# EAGLE design VIC20_SExpII (EAGLE 9.5.2)
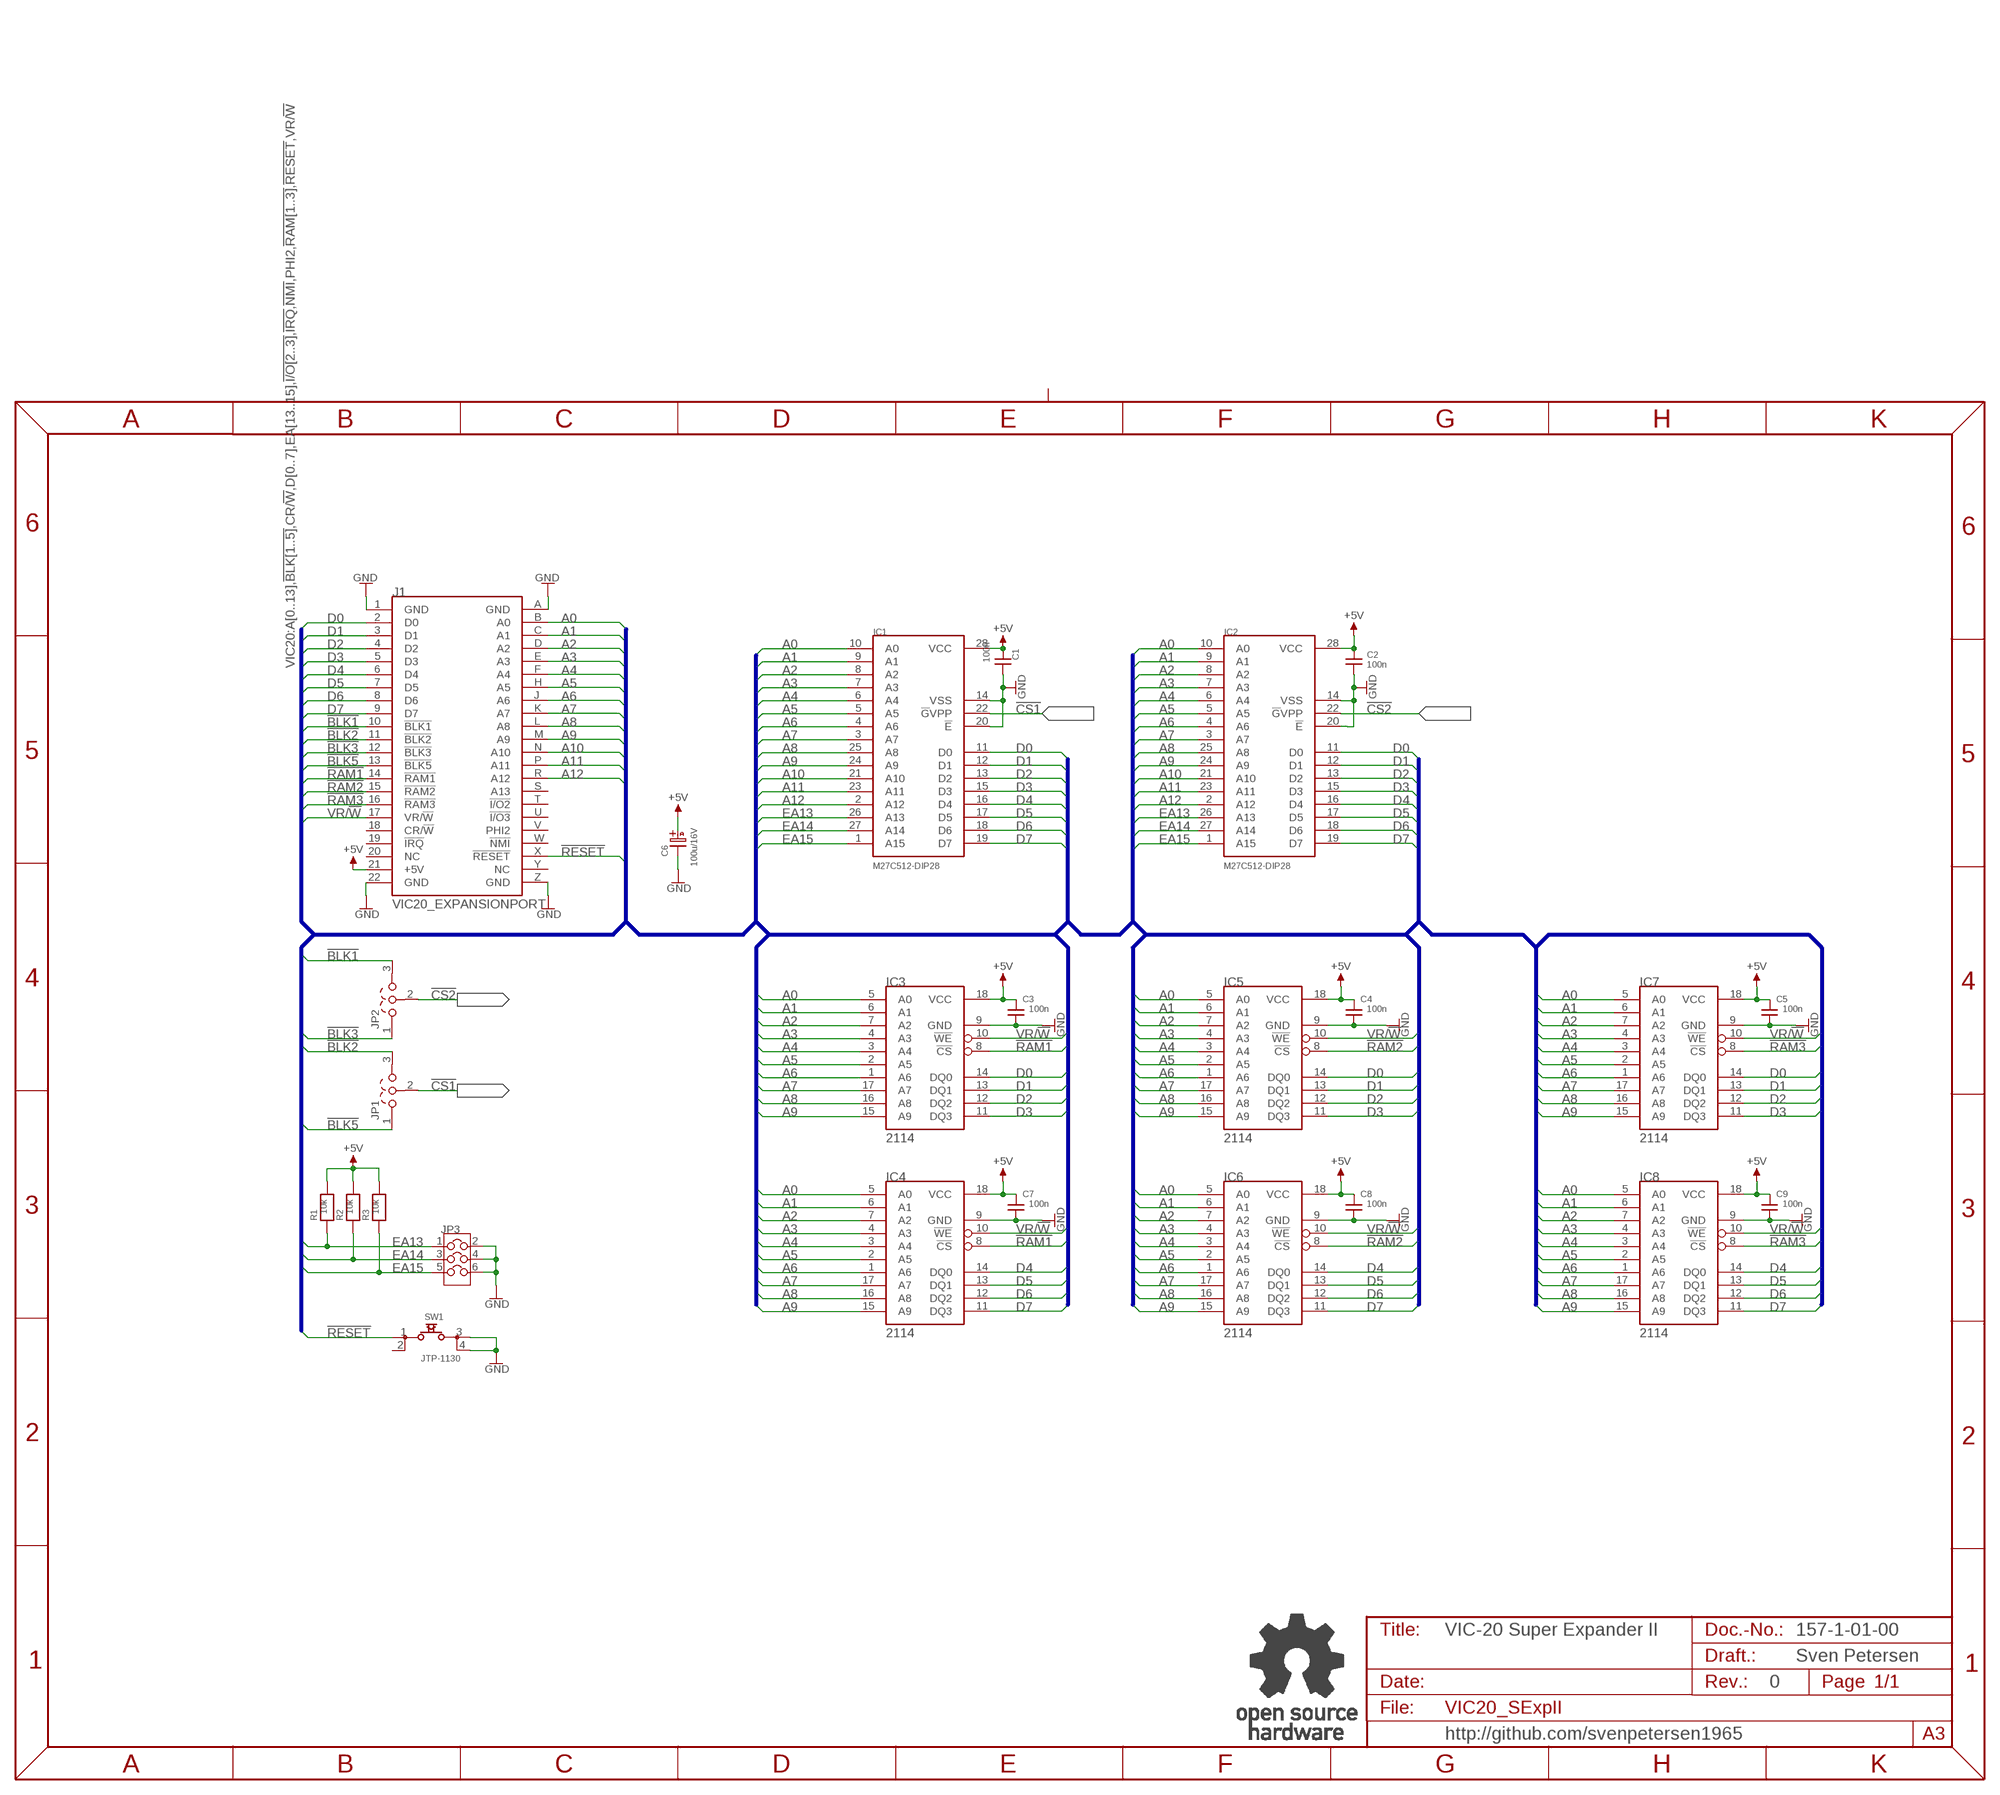
[diagram p0: schematic, sheet 1]

## Parts
C1  100n  CAP01  [C-2,5]
C2  100n  CAP01  [C-2,5]
C3  100n  CAP01  [C-2,5]
C4  100n  CAP01  [C-2,5]
C5  100n  CAP01  [C-2,5]
C6  100u/16V  C07/2,5  [C07/2,5]
C7  100n  CAP01  [C-2,5]
C8  100n  CAP01  [C-2,5]
C9  100n  CAP01  [C-2,5]
IC1  M27C512-DIP28  [DIL28-6]
IC2  M27C512-DIP28  [DIL28-6]
IC3  2114  [DIL18]
IC4  2114  [DIL18]
IC5  2114  [DIL18]
IC6  2114  [DIL18]
IC7  2114  [DIL18]
IC8  2114  [DIL18]
J1  VIC20_EXPANSIONPORT  [VIC20_EXPANSION]
JP1  COMBI-3P  [COMBI-3P]
JP2  COMBI-3P  [COMBI-3P]
JP3  COMBI-3X2P  [COMBI-3X2]
R1  10k  RES04  [R-10]
R2  10k  RES04  [R-10]
R3  10k  RES04  [R-10]
SW1  JTP-1130  [JTP-1130]
U$2  OPEN_SOURCE_HW  [OPENHW]

## Nets
!BLK1: J1.10(!BLK1) JP2.3
!BLK2: J1.11(!BLK2) JP1.3
!BLK3: J1.12(!BLK3) JP2.1
!BLK5: J1.13(!BLK5) JP1.1
!CS1: IC1.22(!G!VPP) JP1.2
!CS2: IC2.22(!G!VPP) JP2.2
!RAM1: IC3.8(!CS) IC4.8(!CS) J1.14(!RAM1)
!RAM2: IC5.8(!CS) IC6.8(!CS) J1.15(!RAM2)
!RAM3: IC7.8(!CS) IC8.8(!CS) J1.16(!RAM3)
!RESET: J1.X(!RESET) SW1.1
+5V: C1.1 C2.1 C3.2 C4.2 C5.2 C6.A(+) C7.2 C8.2 C9.2 IC1.28(VCC) IC2.28(VCC) IC3.18(VCC) IC4.18(VCC) IC5.18(VCC) IC6.18(VCC) IC7.18(VCC) IC8.18(VCC) J1.21(+5V) R1.2 R2.2 R3.2
A0: IC1.10(A0) IC2.10(A0) IC3.5(A0) IC4.5(A0) IC5.5(A0) IC6.5(A0) IC7.5(A0) IC8.5(A0) J1.B(A0)
A1: IC1.9(A1) IC2.9(A1) IC3.6(A1) IC4.6(A1) IC5.6(A1) IC6.6(A1) IC7.6(A1) IC8.6(A1) J1.C(A1)
A2: IC1.8(A2) IC2.8(A2) IC3.7(A2) IC4.7(A2) IC5.7(A2) IC6.7(A2) IC7.7(A2) IC8.7(A2) J1.D(A2)
A3: IC1.7(A3) IC2.7(A3) IC3.4(A3) IC4.4(A3) IC5.4(A3) IC6.4(A3) IC7.4(A3) IC8.4(A3) J1.E(A3)
A4: IC1.6(A4) IC2.6(A4) IC3.3(A4) IC4.3(A4) IC5.3(A4) IC6.3(A4) IC7.3(A4) IC8.3(A4) J1.F(A4)
A5: IC1.5(A5) IC2.5(A5) IC3.2(A5) IC4.2(A5) IC5.2(A5) IC6.2(A5) IC7.2(A5) IC8.2(A5) J1.H(A5)
A6: IC1.4(A6) IC2.4(A6) IC3.1(A6) IC4.1(A6) IC5.1(A6) IC6.1(A6) IC7.1(A6) IC8.1(A6) J1.J(A6)
A7: IC1.3(A7) IC2.3(A7) IC3.17(A7) IC4.17(A7) IC5.17(A7) IC6.17(A7) IC7.17(A7) IC8.17(A7) J1.K(A7)
A8: IC1.25(A8) IC2.25(A8) IC3.16(A8) IC4.16(A8) IC5.16(A8) IC6.16(A8) IC7.16(A8) IC8.16(A8) J1.L(A8)
A9: IC1.24(A9) IC2.24(A9) IC3.15(A9) IC4.15(A9) IC5.15(A9) IC6.15(A9) IC7.15(A9) IC8.15(A9) J1.M(A9)
A10: IC1.21(A10) IC2.21(A10) J1.N(A10)
A11: IC1.23(A11) IC2.23(A11) J1.P(A11)
A12: IC1.2(A12) IC2.2(A12) J1.R(A12)
D0: IC1.11(D0) IC2.11(D0) IC3.14(DQ0) IC5.14(DQ0) IC7.14(DQ0) J1.2(D0)
D1: IC1.12(D1) IC2.12(D1) IC3.13(DQ1) IC5.13(DQ1) IC7.13(DQ1) J1.3(D1)
D2: IC1.13(D2) IC2.13(D2) IC3.12(DQ2) IC5.12(DQ2) IC7.12(DQ2) J1.4(D2)
D3: IC1.15(D3) IC2.15(D3) IC3.11(DQ3) IC5.11(DQ3) IC7.11(DQ3) J1.5(D3)
D4: IC1.16(D4) IC2.16(D4) IC4.14(DQ0) IC6.14(DQ0) IC8.14(DQ0) J1.6(D4)
D5: IC1.17(D5) IC2.17(D5) IC4.13(DQ1) IC6.13(DQ1) IC8.13(DQ1) J1.7(D5)
D6: IC1.18(D6) IC2.18(D6) IC4.12(DQ2) IC6.12(DQ2) IC8.12(DQ2) J1.8(D6)
D7: IC1.19(D7) IC2.19(D7) IC4.11(DQ3) IC6.11(DQ3) IC8.11(DQ3) J1.9(D7)
EA13: IC1.26(A13) IC2.26(A13) JP3.1 R1.1
EA14: IC1.27(A14) IC2.27(A14) JP3.3 R2.1
EA15: IC1.1(A15) IC2.1(A15) JP3.5 R3.1
GND: C1.2 C2.2 C3.1 C4.1 C5.1 C6.K(-) C7.1 C8.1 C9.1 IC1.14(VSS) IC1.20(!E) IC2.14(VSS) IC2.20(!E) IC3.9(GND) IC4.9(GND) IC5.9(GND) IC6.9(GND) IC7.9(GND) IC8.9(GND) J1.1(GND) J1.22(GND) J1.A(GND) J1.Z(GND) JP3.2 JP3.4 JP3.6 SW1.3 SW1.4
VR/!W: IC3.10(!WE) IC4.10(!WE) IC5.10(!WE) IC6.10(!WE) IC7.10(!WE) IC8.10(!WE) J1.17(VR/!W)
Unconnected: J1.18(CR/!W) J1.19(!IRQ) J1.S(A13) J1.T(!I/O2) J1.U(!I/O3) J1.V(PHI2) J1.W(!NMI) J1.Y(NC) SW1.2

## Buses
VIC20:A[0..13],!BLK[1..5],CR/!W,D[0..7],EA[13..15],!I/O[2..3],!IRQ,!NMI,PHI2,!RAM[1..3],!RESET,VR/!W

## Notes on the sheet
- VIC-20 Super Expander II | 157-1-01-00
- Sven Petersen
- 0
- http://github.com/svenpetersen1965

## Power pins joined to a net without a drawn wire
NC: J1.20(NC)

## Library data of the parts
C1-C5 C7-C9 = DISCRETE:CAP01
C6 = ELCO:C07/2,5
IC1 IC2 = ST:M27C512
IC3-IC8 = MOS:2114
J1 = Commodore:VIC20_EXPANSIONPORT
JP1 JP2 = Cutpad:COMBI-3P
JP3 = Cutpad:COMBI-3X2P
R1-R3 = DISCRETE:RES04
SW1 = Namae_Electronics:JTP-1130
U$2 = Logo:OPEN_SOURCE_HW

## Board
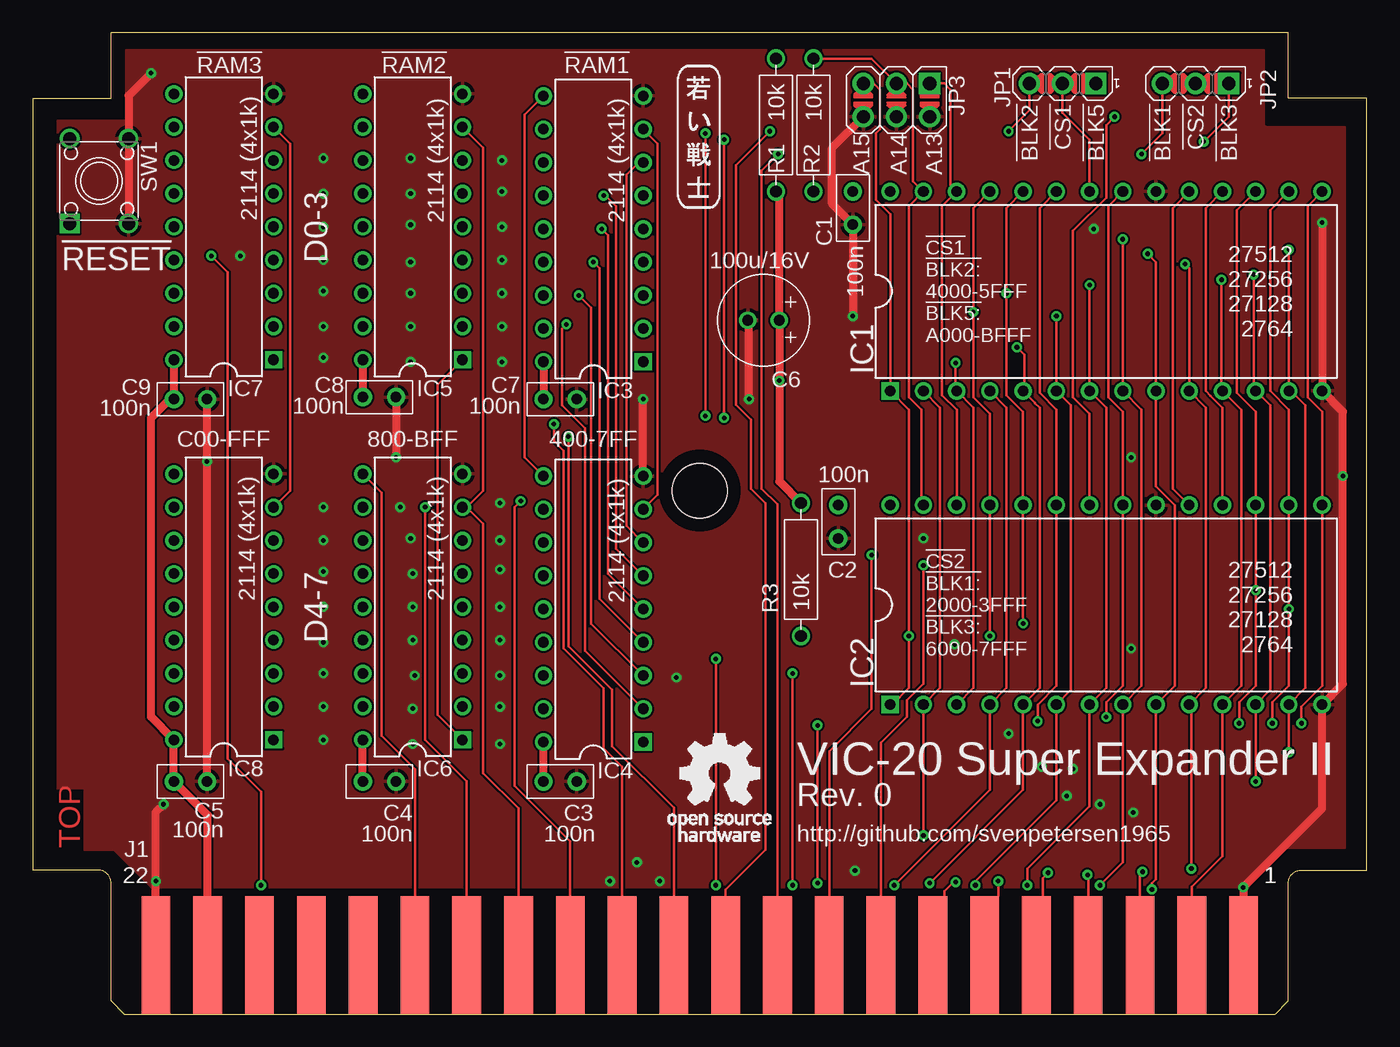
[diagram p1: board, top side]
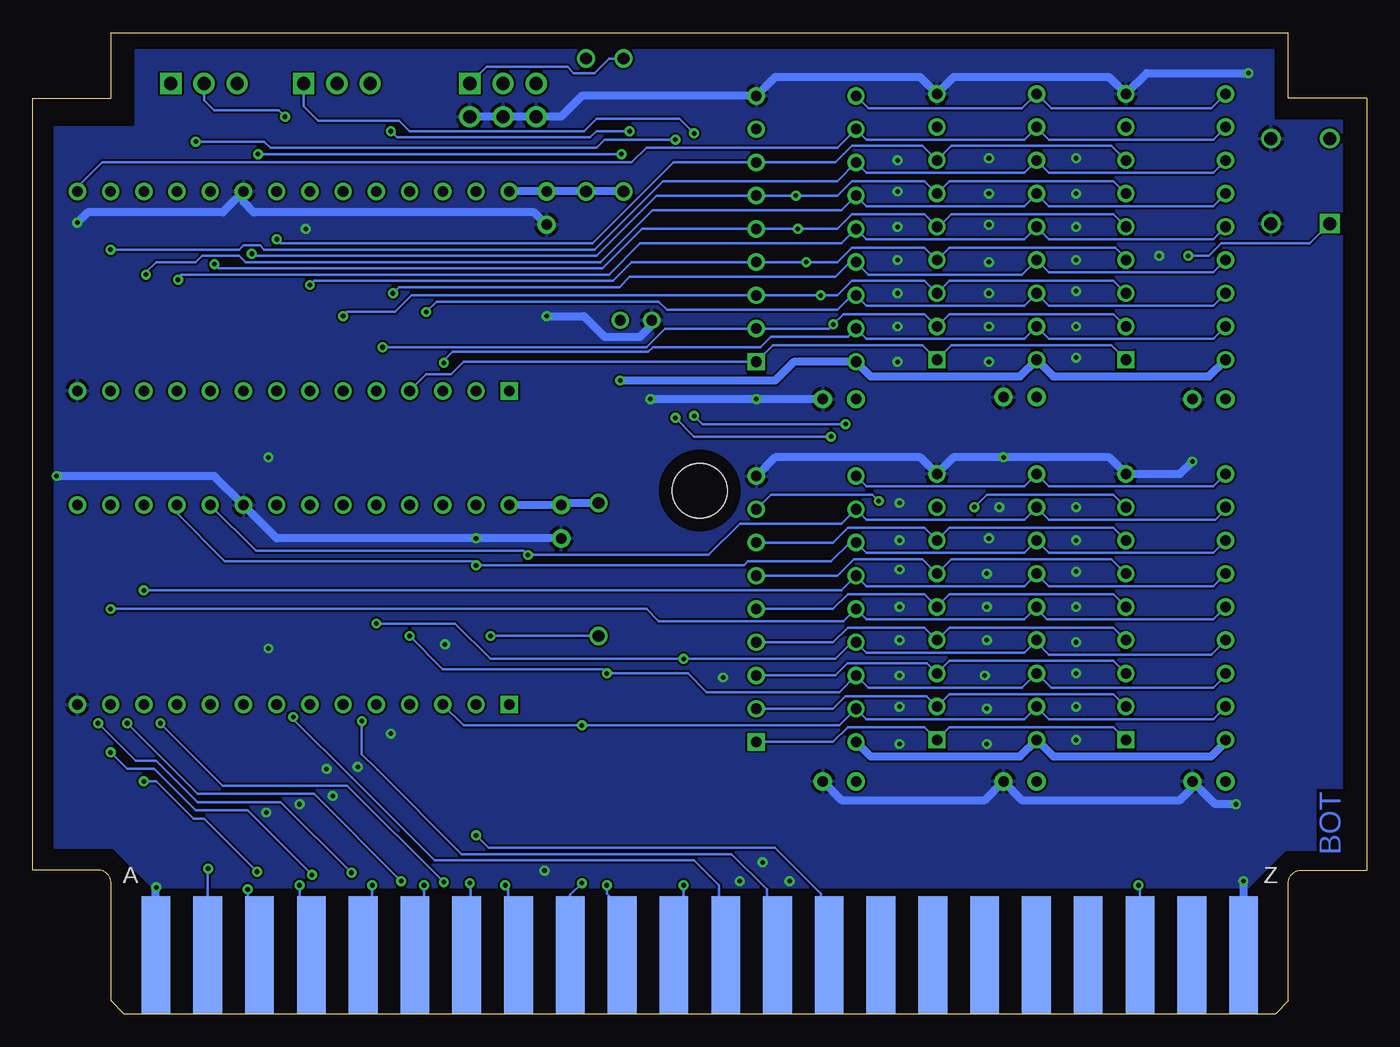
[diagram p2: board, bottom side, seen from below]

Size 102 x 75 mm. Coordinates in mm from the lower left corner, seen from the top.
Outline: 102,11 102,70 96,70 96,75 6,75 6,70 0,70 0,11
Copper layers (1*16): Top 0.035mm / dielectric 1.5mm / Bottom 0.035mm
Design rules "default *": minimum track width 6mil, minimum drill 0.35mm, track to track 6mil, track to pad 6mil, pad to pad 6mil, via to via 6mil, smd to smd 6mil, copper to edge 40mil, drill to drill 6mil, minimum pad ring 10mil, minimum via ring 8mil, stop-mask expansion 4mil, vias tented up to drill 23mil, thermal gap 10mil
Holes 4.2 mm at 51,40

### Footprints (pad centres in the part's own frame; a part is rotated, then mirrored left to right if it is on the bottom)
C-2,5 = drill 0.8 pad 1.397: 1 -1.27,0; 2 1.27,0
C07/2,5 = drill 0.813 pad 1.27: A -1.202,0; K 1.202,0
DIL28-6 = drill 0.813 square: 1 -16.51,-7.62 | drill 0.813: 2 -13.97,-7.62; 3 -11.43,-7.62; 4 -8.89,-7.62; 5 -6.35,-7.62; 6 -3.81,-7.62; 7 -1.27,-7.62; 8 1.27,-7.62; 9 3.81,-7.62; 10 6.35,-7.62; 11 8.89,-7.62; 12 11.43,-7.62; 13 13.97,-7.62; 14 16.51,-7.62; 15 16.51,7.62; 16 13.97,7.62; 17 11.43,7.62; 18 8.89,7.62; 19 6.35,7.62; 20 3.81,7.62; 21 1.27,7.62; 22 -1.27,7.62; 23 -3.81,7.62; 24 -6.35,7.62; 25 -8.89,7.62; 26 -11.43,7.62; 27 -13.97,7.62; 28 -16.51,7.62
DIL18 = drill 0.813 square: 1 -10.16,-3.81 | drill 0.813: 2 -7.62,-3.81; 3 -5.08,-3.81; 4 -2.54,-3.81; 5 0,-3.81; 6 2.54,-3.81; 7 5.08,-3.81; 8 7.62,-3.81; 9 10.16,-3.81; 10 10.16,3.81; 11 7.62,3.81; 12 5.08,3.81; 13 2.54,3.81; 14 0,3.81; 15 -2.54,3.81; 16 -5.08,3.81; 17 -7.62,3.81; 18 -10.16,3.81
VIC20_EXPANSION = smd 2.2 x 9: 1 41.58,4.5; 2 37.62,4.5; 3 33.66,4.5; 4 29.7,4.5; 5 25.74,4.5; 6 21.78,4.5; 7 17.82,4.5; 8 13.86,4.5; 9 9.9,4.5; 10 5.94,4.5; 11 1.98,4.5; 12 -1.98,4.5; 13 -5.94,4.5; 14 -9.9,4.5; 15 -13.86,4.5; 16 -17.82,4.5; 17 -21.78,4.5; 18 -25.74,4.5; 19 -29.7,4.5; 20 -33.66,4.5; 21 -37.62,4.5; 22 -41.58,4.5 | smd 2.2 x 9 bottom: A 41.58,4.5; B 37.62,4.5; C 33.66,4.5; D 29.7,4.5; E 25.74,4.5; F 21.78,4.5; H 17.82,4.5; J 13.86,4.5; K 9.9,4.5; L 5.94,4.5; M 1.98,4.5; N -1.98,4.5; P -5.94,4.5; R -9.9,4.5; S -13.86,4.5; T -17.82,4.5; U -21.78,4.5; V -25.74,4.5; W -29.7,4.5; X -33.66,4.5; Y -37.62,4.5; Z -41.58,4.5
COMBI-3P = drill 1 pad 1.626 square: 1 -2.54,0 | drill 1 pad 1.626: 2 0,0; 3 2.54,0
COMBI-3X2 = drill 1 pad 1.626 square: 1 -1.27,2.54 | drill 1 pad 1.626: 2 1.27,2.54; 3 -1.27,0; 4 1.27,0; 5 -1.27,-2.54; 6 1.27,-2.54
R-10 = drill 0.889 pad 1.397: 1 -5.08,0; 2 5.08,0
JTP-1130 = drill 1 square: 1 3.25,-2.25 | drill 1: 2 -3.25,-2.25; 3 3.25,2.25; 4 -3.25,2.25

### Placement (x,y rotation side)
C1  62.71,61.59 270 top
C2  61.59,37.62 270 top
C3  40.32,17.78 180 top
C4  26.51,17.78 180 top
C5  12.06,17.78 180 top
C6  55.88,53.02 180 top
C7  40.32,46.99 180 top
C8  26.51,47.15 180 top
C9  12.06,46.99 180 top
IC1  82.07,55.24 0 top
IC2  82.07,31.27 0 top
IC3  42.86,60.01 90 top
IC4  42.86,30.96 90 top
IC5  29.05,60.17 90 top
IC6  29.05,31.11 90 top
IC7  14.61,60.17 90 top
IC8  14.61,31.11 90 top
J1  51,0 0 top
JP1  78.74,71.12 180 top
JP2  88.9,71.12 180 top
JP3  66.04,69.85 270 top
R1  56.83,67.94 270 top
R2  59.69,67.94 270 top
R3  58.74,33.97 90 top
SW1  5.08,63.66 270 top
U$2  48.58,13.18 0 top
U$15  [SVEN_TAG]  50.96,67.15 0 top
U$16  [2LAYER]  3.65,12.7 90 top
U$40  [PCB-TITLE/]  0,87 0 top  (outside the outline)

### Tracks (layer width: path | path; a pad name or v marks a point on that pad's centre or on a via)
!BLK1  (via drill 0.35)
  Top 0.203: J1.10 56.94,38.95 55.72,40.16 55.72,64.45 v56.99,65.72 | v84.77,65.72 86.36,67.31 JP2.3
  Bottom 0.203: v56.99,65.72 v84.77,65.72
!BLK2  (via drill 0.35)
  Top 0.203: J1.11 52.98,9.48 56.04,12.54 56.04,39.05 54.93,40.16 54.93,45.4 53.76,46.57 53.76,64.88 v56.36,67.47 | v74.61,67.47 76.2,69.06 JP1.3
  Bottom 0.203: v56.36,67.47 58.9,67.47 59.37,66.99 74.14,66.99 v74.61,67.47
!BLK3  (via drill 0.35)
  Top 0.203: J1.12 49.02,15.75 44.29,20.48 44.29,24.77 40.96,28.1 v40.96,44.13 | v52.86,45.56 v52.86,66.83 | v89.53,66.67 91.44,68.58 JP2.1
  Bottom 0.203: v40.96,44.13 51.44,44.13 v52.86,45.56 | v52.86,66.83 58.26,66.83 58.9,66.2 83.82,66.2 84.3,66.67 v89.53,66.67
!BLK5  (via drill 0.35)
  Top 0.203: J1.13 45.06,18.92 43.66,20.32 43.66,24.9 40.6,27.95 40.6,43.06 39.85,43.81 v39.85,45.09 | v51.44,45.72 v51.44,67.31
  Bottom 0.203: v39.85,45.09 50.8,45.09 v51.44,45.72 | v51.44,67.31 52.55,68.42 58.9,68.42 59.85,67.47 73.18,67.47 73.98,68.26 80.17,68.26 81.28,69.37 JP1.1
!CS1
  Top 0.203: IC1.22 80.8,66.83 78.74,68.9 JP1.2
!CS2  (via drill 0.35)
  Top 0.203: IC2.22 80.8,45.88 79.53,47.15 79.53,59.85 82.07,62.39 82.07,67.94 v82.71,68.58
  Bottom 0.203: v82.71,68.58 83.19,69.06 88.11,69.06 88.9,69.85 JP2.2
!RAM1  (via drill 0.35)
  Top 0.203: IC4.8 47.78,39.69 47.78,41.33 47.78,66.52 IC3.8 | J1.14 41.1,13.19 36.83,17.46 36.83,38.73 v37.31,39.21
  Bottom 0.203: v37.31,39.21 37.78,39.69 45.56,39.69 IC4.8
!RAM2
  Top 0.203: IC5.8 34.45,66.2 34.45,40.01 33.18,38.73 | 33.18,38.73 IC6.8 33.18,38.73 | J1.15 37.14,15.72 34.45,18.41 34.45,37.47 33.18,38.73
!RAM3  (via drill 0.35)
  Top 0.203: J1.16 33.18,17.78 30,20.95 v30,38.73 | IC8.8 19.68,40.01 19.68,66.52 IC7.8
  Bottom 0.203: v30,38.73 29.05,39.69 19.37,39.69 IC8.8
!RESET  (via drill 0.35)
  Top 0.203: v17.46,9.84 17.46,16.99 14.92,19.53 14.92,56.67 v13.65,57.94
  Bottom 0.203: J1.X 17.34,9.72 v17.46,9.84 | v13.65,57.94 12.06,57.94 11.11,58.9 4.34,58.9 SW1.1
+5V  (via drill 0.35)
  Top 0.61: R1.2 57.08,62.62 C6.A v57.08,48.42 57.08,40.71 R3.2 | IC3.18 C7.2 | IC5.18 C8.2 | IC7.18 C9.2 10.48,46.99 9.05,45.56 9.05,22.7 IC8.18 C5.2 13.38,15.2 J1.21 | C4.2 IC6.18 | C3.2 IC4.18
  Bottom 0.61: IC7.18 12.06,48.74 23.97,48.74 IC5.18 26.51,48.74 37.94,48.74 IC3.18 43.81,49.85 45.24,48.42 v57.08,48.42 | IC4.18 37.94,19.68 26.51,19.68 IC6.18 23.97,19.68 11.91,19.68 10.79,20.8 IC8.18 | R1.2 R2.2 C1.1 IC1.28 | v57.08,48.42 57.15,48.42 v57.08,48.42 | R3.2 61.44,39.05 C2.1 IC2.28
A0  (via drill 0.35)
  Top 0.203: v88.11,57.31 88.42,56.99 IC1.10 89.69,46.35 89.69,24.92 IC2.10 88.58,23.5 v88.58,11.11 | IC4.5 43.97,33.66 43.97,59.53 v43.5,60.01
  Bottom 0.203: IC7.5 19.37,61.12 31.75,61.12 32.7,60.17 IC5.5 33.81,61.12 39.37,61.12 40.48,60.01 v43.5,60.01 IC3.5 55.4,60.01 58.42,56.99 87.79,56.99 v88.11,57.31 | IC4.5 40.8,30.96 39.69,32.07 33.81,32.07 IC6.5 31.91,32.07 19.37,32.07 IC8.5 | J1.B 88.62,11.07 v88.58,11.11
A1  (via drill 0.35)
  Top 0.203: v85.25,58.1 85.88,57.47 IC1.9 85.88,40.32 87.31,38.89 87.31,25.08 IC2.9 85.88,10.32 85.57,10 v85.57,9.53 | IC4.6 44.61,35.56 44.61,61.75 43.81,62.55 v43.66,62.55
  Bottom 0.203: IC7.6 19.37,63.66 31.91,63.66 IC5.6 33.81,63.66 39.37,63.66 40.48,62.55 v43.66,62.55 IC3.6 54.29,62.55 58.9,57.94 85.09,57.94 v85.25,58.1 | IC4.6 40.48,33.5 39.21,34.77 33.97,34.77 IC6.6 31.75,34.77 19.53,34.77 IC8.6 | v85.57,9.53 85.57,5.41 J1.C
A2  (via drill 0.35)
  Top 0.203: v83.34,59.21 IC1.8 84.77,46.2 84.77,25.08 IC2.8 83.34,11.59 v81.6,9.84 | IC4.7 45.4,37.31 45.4,64.14 46.35,65.09 IC3.7
  Bottom 0.203: IC7.7 19.53,66.36 31.75,66.36 IC5.7 33.97,66.36 39.37,66.36 40.64,65.09 IC3.7 53.02,65.09 59.21,58.9 83.03,58.9 v83.34,59.21 | IC4.7 40.8,36.04 39.69,37.15 33.81,37.15 IC6.7 31.91,37.15 19.37,37.15 IC8.7 | v81.6,9.84 81.6,5.4 J1.D
A3  (via drill 0.35)
  Top 0.203: v80.8,55.72 IC1.7 82.07,46.35 82.07,24.92 IC2.7 80.8,15.88 76.04,11.11 v76.04,9.84 | IC4.4 43.34,31.75 43.34,56.99 v42.86,57.47
  Bottom 0.203: IC7.4 18.41,57.78 19.21,58.58 31.91,58.58 IC5.4 33.81,58.58 39.37,58.58 40.48,57.47 v42.86,57.47 IC3.4 56.2,57.47 57.63,56.04 80.49,56.04 v80.8,55.72 | IC4.4 40.8,28.42 39.69,29.53 33.81,29.53 IC6.4 31.91,29.53 19.37,29.53 IC8.4 | v76.04,9.84 76.04,5.2 J1.E
A4  (via drill 0.35)
  Top 0.203: v78.26,53.34 IC1.6 79.38,46.51 79.38,24.77 IC2.6 78.26,16.35 72.07,10.16 v72.07,9.84 | IC4.3 42.7,29.84 42.7,53.98 v41.75,54.93
  Bottom 0.203: IC7.3 19.37,56.04 31.91,56.04 IC5.3 33.81,56.04 39.37,56.04 40.48,54.93 v41.75,54.93 IC3.3 56.99,54.93 73.03,54.93 74.3,53.66 77.95,53.66 v78.26,53.34 | IC4.3 40.64,25.88 39.73,26.79 33.62,26.79 IC6.3 31.91,26.99 19.37,26.99 IC8.3 | J1.F 72.07,5.21 v72.07,9.84
A5  (via drill 0.35)
  Top 0.203: 75.8,47.55 76.64,46.71 76.64,46.68 76.99,46.33 76.99,24.92 IC2.5 75.72,17.14 v68.58,10 | 75.8,47.55 IC1.5 | v75.25,50.96 75.8,50.4 75.8,47.55 | IC4.2 42.23,27.78 42.23,44.77 40.48,46.51 40.48,52.39 v40.8,52.7
  Bottom 0.203: IC7.2 19.37,53.5 31.91,53.5 IC5.2 33.81,53.5 40.01,53.5 v40.8,52.7 41.12,52.39 IC3.2 53.66,52.39 55.09,50.96 v75.25,50.96 | IC4.2 40.8,23.34 39.85,24.29 33.66,24.29 IC6.2 31.91,24.45 19.37,24.45 IC8.2 | J1.H 68.5,4.82 68.5,9.92 v68.58,10
A6  (via drill 0.35)
  Top 0.203: IC1.4 74.45,46.35 74.45,24.92 IC2.4 73.18,17.14 v65.88,9.84 | IC6.1 30.96,22.86 30.96,48.1 IC5.1
  Bottom 0.203: IC7.1 19.53,51.12 31.75,51.12 IC5.1 33.97,51.12 45.4,51.12 IC3.1 69.06,49.85 70.01,48.9 71.91,48.9 IC1.4 | IC4.1 40.8,20.8 39.69,21.91 33.81,21.91 IC6.1 31.91,21.91 19.37,21.91 IC8.1 | v65.88,9.84 65.65,9.62 65.65,5.29 J1.J
A7  (via drill 0.35)
  Top 0.203: IC2.3 71.91,24.92 71.91,46.35 IC1.3 70.56,47.7 v70.56,49.77 | v60.01,10 v60.01,22.07
  Bottom 0.203: IC7.17 11.75,51.59 24.29,51.59 IC5.17 26.19,51.59 38.26,51.59 IC3.17 39.69,51.75 45.56,51.75 46.35,50.96 54.58,50.96 54.94,50.6 69.89,50.6 70.64,49.85 v70.56,49.77 | IC8.17 11.75,22.54 24.29,22.54 IC6.17 26.19,22.54 38.26,22.54 IC4.17 40.32,22.07 v60.01,22.07 69.06,22.07 IC2.3 | J1.K 60.9,9.11 v60.01,10
A8  (via drill 0.35)
  Top 0.203: IC1.25 71.91,61.59 v71.91,53.66 71.91,47.15 73.18,45.88 IC2.25 v73.18,28.89 | v58.1,9.84 v58.1,26.04
  Bottom 0.203: IC7.16 11.75,54.13 24.29,54.13 IC5.16 26.19,54.13 38.26,54.13 IC3.16 39.37,54.93 40.48,53.82 53.5,53.82 54.13,54.45 71.12,54.45 v71.91,53.66 | IC8.16 10.79,25.88 11.75,24.92 24.13,24.92 IC6.16 26.35,24.92 38.1,24.92 IC4.16 40.32,24.61 50.48,24.61 51.91,26.04 v58.1,26.04 58.42,26.35 70.64,26.35 v73.18,28.89 | J1.L 56.94,8.04 58.1,9.21 v58.1,9.84
A9  (via drill 0.35)
  Top 0.203: IC1.24 74.45,61.59 v74.45,55.09 74.45,47.31 75.72,46.04 IC2.24 v75.72,29.84 | v52.23,9.84 v52.23,27.15
  Bottom 0.203: IC7.15 11.75,56.67 24.29,56.67 IC5.15 26.35,56.52 38.1,56.52 IC3.15 39.53,57.47 40.64,56.36 56.36,56.36 57.15,55.56 73.98,55.56 v74.45,55.09 | IC8.15 11.91,27.46 24.29,27.46 25.24,28.42 IC6.15 26.19,27.62 38.26,27.62 IC4.15 39.37,28.42 40.64,27.15 v52.23,27.15 66.99,27.15 69.69,29.84 v75.72,29.84 | J1.M 52.23,5.25 v52.23,9.84
A10  (via drill 0.35)
  Top 0.203: IC1.21 82.23,61.75 82.23,47.15 83.34,46.04 IC2.21 83.34,25.08 82.07,23.81 v82.07,22.7
  Bottom 0.203: J1.N 49.53,5.01 49.53,9.84 51.44,11.75 71.28,11.75 77.63,18.1 82.07,22.54 v82.07,22.7
A11  (via drill 0.35)
  Top 0.203: IC1.23 76.99,61.59 76.99,47.47 78.26,46.2 IC2.23 78.26,25.08 76.83,23.65 v76.83,22.38
  Bottom 0.203: J1.P 45.88,5.32 45.88,9.53 48.58,12.22 69.22,12.22 75.64,18.65 76.83,19.84 v76.83,22.38
A12  (via drill 0.35)
  Top 0.203: IC1.2 69.37,46.35 69.37,24.92 IC2.2 v68.1,13.65
  Bottom 0.203: J1.R 41.75,5.15 41.75,9.21 45.24,12.7 67.15,12.7 v68.1,13.65
D0  (via drill 0.35)
  Top 0.203: J1.2 88.62,9.72 90.96,12.06 IC2.11 92.39,25.08 92.39,46.2 IC1.11 90.88,47.7 v90.88,56.12
  Bottom 0.203: IC7.14 11.75,59.21 24.29,59.21 IC5.14 26.19,59.21 38.26,59.21 IC3.14 40.16,58.9 55.56,58.9 57.94,56.52 90.65,56.52 90.96,56.2 v90.88,56.12
D1  (via drill 0.35)
  Top 0.203: v93.34,56.52 93.34,47.78 IC1.12 94.61,46.51 94.61,24.77 IC2.12 v93.5,17.78 | J1.3 84.66,10.52 84.93,10.79 v84.85,10.87
  Bottom 0.203: IC7.13 11.75,61.75 24.29,61.75 IC5.13 26.19,61.75 38.26,61.75 IC3.13 40.16,61.44 54.61,61.44 58.58,57.47 85.72,57.47 86.2,57.94 89.06,57.94 89.53,57.47 92.55,57.47 93.34,56.67 v93.34,56.52 | v84.85,10.87 88.9,14.92 89.69,14.92 92.55,17.78 v93.5,17.78
D2  (via drill 0.35)
  Top 0.203: v96.04,58.42 IC1.13 96.2,47.62 97.31,46.51 97.31,24.92 IC2.13 96.04,20.16 v96.04,20 | J1.4 80.7,10.58 v80.64,10.64
  Bottom 0.203: IC7.12 11.75,64.29 24.29,64.29 IC5.12 26.19,64.29 38.26,64.29 IC3.12 40.48,63.66 53.82,63.66 59.05,58.42 84.3,58.42 84.61,58.74 85.88,58.74 86.2,58.42 v96.04,58.42 | v80.64,10.64 85.57,15.56 89.53,15.56 92.71,18.73 94.77,18.73 v96.04,20
D3  (via drill 0.35)
  Top 0.203: IC1.15 97.47,61.75 97.47,47.15 98.58,46.04 IC2.15 98.58,25.08 97,23.5 v97,22.23 | J1.5 77.22,4.98 77.22,10.38 v77.63,10.79
  Bottom 0.203: IC7.11 11.75,66.83 24.29,66.83 IC5.11 26.19,66.83 38.26,66.83 IC3.11 40.48,66.2 55.09,66.2 56.2,65.09 96.68,65.09 98.58,63.18 IC1.15 | v77.63,10.79 83.03,16.19 89.38,16.19 92.55,19.37 94.14,19.37 v97,22.23
D4  (via drill 0.35)
  Top 0.203: IC1.16 94.61,61.44 94.61,47.62 96.04,46.2 IC2.16 v96.04,30.96 96.04,25.08 94.77,23.81 v94.77,22.23 | J1.6 72.78,8.01 73.82,9.05 v73.82,10.16
  Bottom 0.203: IC8.14 11.75,30.16 24.45,30.16 25.24,30.96 IC6.14 26.19,30.16 38.26,30.16 IC4.14 40.01,30 54.13,30 55.09,30.96 95.57,30.96 v96.04,30.96 | v73.82,10.16 80.49,16.83 89.38,16.83 v94.77,22.23
D5  (via drill 0.35)
  Top 0.203: IC1.17 92.08,61.44 92.08,47.47 93.5,46.04 IC2.17 v93.5,32.38 93.5,25.08 92.23,23.81 v92.23,22.23 | J1.7 69.69,5.37 69.69,9.37 70.48,10.16 v70.56,10.08
  Bottom 0.203: IC8.13 11.75,32.7 24.29,32.7 IC6.13 26.19,32.7 38.26,32.7 IC4.13 40.16,32.38 v93.5,32.38 | v70.56,10.08 77.95,17.46 87.47,17.46 v92.23,22.23
D6  (via drill 0.35)
  Top 0.203: IC2.18 90.96,46.33 90.05,47.25 90.05,47.27 89.69,47.62 89.69,61.59 IC1.18 | J1.8 64.86,20.73 66.83,22.7 66.83,23.97 68.1,25.24 v68.1,34.29
  Bottom 0.203: IC8.12 11.75,35.24 24.29,35.24 IC6.12 26.19,35.24 38.26,35.24 IC4.12 39.53,36.04 40.96,34.61 47.31,34.61 47.62,34.29 v68.1,34.29 68.42,34.61 87.31,34.61 90.96,38.26 IC2.18
D7  (via drill 0.35)
  Top 0.203: IC1.19 87.15,61.59 87.15,40.16 IC2.19 | J1.9 60.9,20.1 64.14,23.34 v64.14,35.08
  Bottom 0.203: IC8.11 10.79,38.58 11.59,37.78 24.29,37.78 IC6.11 26.19,37.78 38.26,37.78 IC4.11 40.16,37.47 47.94,37.47 50.32,35.08 v64.14,35.08 64.45,35.4 84.93,35.4 IC2.19
EA13
  Top 0.203: IC2.26 70.64,46.2 69.53,47.31 69.53,61.75 IC1.26 70.17,63.34 70.17,70.64 69.69,71.12 JP3.1
  Bottom 0.203: R1.1 57.94,73.03 59.05,71.91 60.64,71.91 61.12,72.39 67.31,72.39 JP3.1
EA14
  Top 0.203: IC2.27 67.94,39.05 67.94,46.2 66.99,47.15 66.99,61.75 IC1.27 67.31,63.66 67.31,70.64 66.83,71.12 JP3.3 64.14,73.03 R2.1
EA15  (via drill 0.35)
  Top 0.203: IC2.1 65.72,23.65 66.99,24.92 v66.99,28.89 66.99,46.2 IC1.1 65.56,61.12 64.45,62.23 64.45,67.31 64.77,67.63 64.77,70.64 64.29,71.12 JP3.5
  Bottom 0.203: R3.1 v66.99,28.89
GND  (via drill 0.35)
  Top 0.61: v9.05,71.91 7.33,70.19 SW1.4 SW1.3 | JP3.6 61.12,66.2 61.12,61.91 C1.2 v62.71,53.34 | v98.58,60.48 IC1.14 100.17,46.04 v100.17,41.12 100.17,25.24 IC2.14 98.58,15.72 v92.55,9.68 92.55,4.53 J1.A | v54.77,46.99 54.77,52.93 C6.K | IC4.9 v46.67,46.99 | C8.1 v27.78,42.55 | C9.1 v13.34,42.23 C5.1 | J1.Z v9.42,10.16 9.42,15.45 v10,16.03
  Bottom 0.61: IC4.9 45.24,42.55 34.13,42.55 IC6.9 31.59,42.55 v27.78,42.55 19.68,42.55 IC8.9 14.29,41.27 v13.34,42.23 | JP3.2 JP3.4 JP3.6 61.59,68.58 60.01,70.17 IC3.9 45.24,71.6 34.13,71.6 IC5.9 31.59,71.6 19.68,71.6 IC7.9 16.83,71.91 v9.05,71.91 | C1.2 63.66,61.28 85.09,61.28 85.88,62.07 IC1.20 87.47,61.28 97.79,61.28 v98.58,60.48 | v100.17,41.12 88.11,41.12 IC2.20 83.34,36.35 C2.2 | v62.71,53.34 59.85,53.34 58.26,51.75 55.56,51.75 54.68,52.64 C6.K | C7.1 v46.67,46.99 v54.77,46.99 | C3.1 40.16,16.35 29.21,16.35 C4.1 26.35,16.35 14.29,16.35 13.34,17.3 C5.1 11.59,16.03 v10,16.03 | J1.A 92.58,9.65 v92.55,9.68 | J1.Z 9.42,10.05 9.53,10.16 v9.42,10.16
  other vias: 62.87,10.95 46.2,11.59 84.14,15.4 81.6,16.03 79.06,16.67 70.48,28.26 49.21,25.72 22.23,20.95 22.23,23.5 22.23,26.04 22.23,28.42 22.23,31.11 22.23,33.81 22.23,36.2 22.23,38.73 28.1,38.73 28.89,36.35 29.05,33.66 29.05,31.11 29.05,28.57 29.21,25.88 29.05,23.34 29.05,20.64 35.72,20.64 35.72,23.5 35.72,25.88 35.72,28.57 35.72,31.11 35.72,33.97 35.72,36.2 35.72,39.05 22.23,50.16 22.23,52.55 22.23,55.24 22.23,57.63 22.23,60.17 22.23,62.71 22.23,65.41 28.89,65.41 28.89,62.71 28.89,60.33 28.89,57.47 28.89,55.09 28.89,52.55 28.89,49.85 35.88,49.85 35.88,52.55 35.88,55.09 35.88,57.63 35.88,60.17 35.88,62.87 35.88,65.25 15.88,57.94 81.12,60.01 74.61,21.43 77.15,18.89 44.13,10.16 47.94,10.16 79.53,18.73 68.1,36.35 83.98,42.55 83.98,27.94
  pour Top: 1.91,68.26 7.14,68.26 7.14,73.66 94.14,73.66 94.14,67.94 94.3,67.79 100.33,67.79 100.33,12.7 95.89,12.7 95.73,12.86 92.55,9.68 9.05,9.68 6.19,12.54 1.91,12.54
  pour Bottom: 1.91,68.26 7.14,68.26 7.14,73.66 94.14,73.66 94.14,67.94 94.3,67.79 100.33,67.79 100.33,12.7 95.89,12.7 92.87,9.68 91.6,9.68 9.05,9.68 6.19,12.54 1.91,12.54
VR/!W
  Top 0.203: IC3.10 37.62,68.74 37.62,42.55 IC4.10 | J1.17 29.22,18.72 26.67,21.27 26.67,39.85 IC6.10
  Bottom 0.203: IC3.10 38.1,69.22 26.35,69.22 IC5.10 24.13,69.22 11.91,69.22 IC7.10 | IC4.10 38.26,40.32 26.19,40.32 IC6.10 24.29,40.32 11.75,40.32 IC8.10

### Text on the board
tPlace: Sven Petersen / 2020 | !RAM3 | !RAM2 | !RAM1 | 10k | 10k | !BLK2 | !CS1 | !BLK5 | !BLK1 | !CS2 | !BLK3 | A15 | A14 | A13 | 2114 (4x1k) | D0-3 | 2114 (4x1k) | 2114 (4x1k) | 100n | 100u/16V | !RESET | !CS1 / !BLK2: / 4000-5FFF / !BLK5: / A000-BFFF | 27512 / 27256 / 27128 / 2764 | 100n | 100n | 100n | C00-FFF | 800-BFF | 400-7FF | 100n | 2114 (4x1k) | 2114 (4x1k) | D4-7 | 2114 (4x1k) | 10k | !CS2 / !BLK1: / 2000-3FFF / !BLK3: / 6000-7FFF | 27512 / 27256 / 27128 / 2764 | VIC-20 Super Expander II | Rev. 0 | 100n | 100n | 100n | http://github.com/svenpetersen1965
Document: 157-2-01-00 | 35µm | 2 | 0